# EAGLE design main-board (EAGLE 9.6.2)
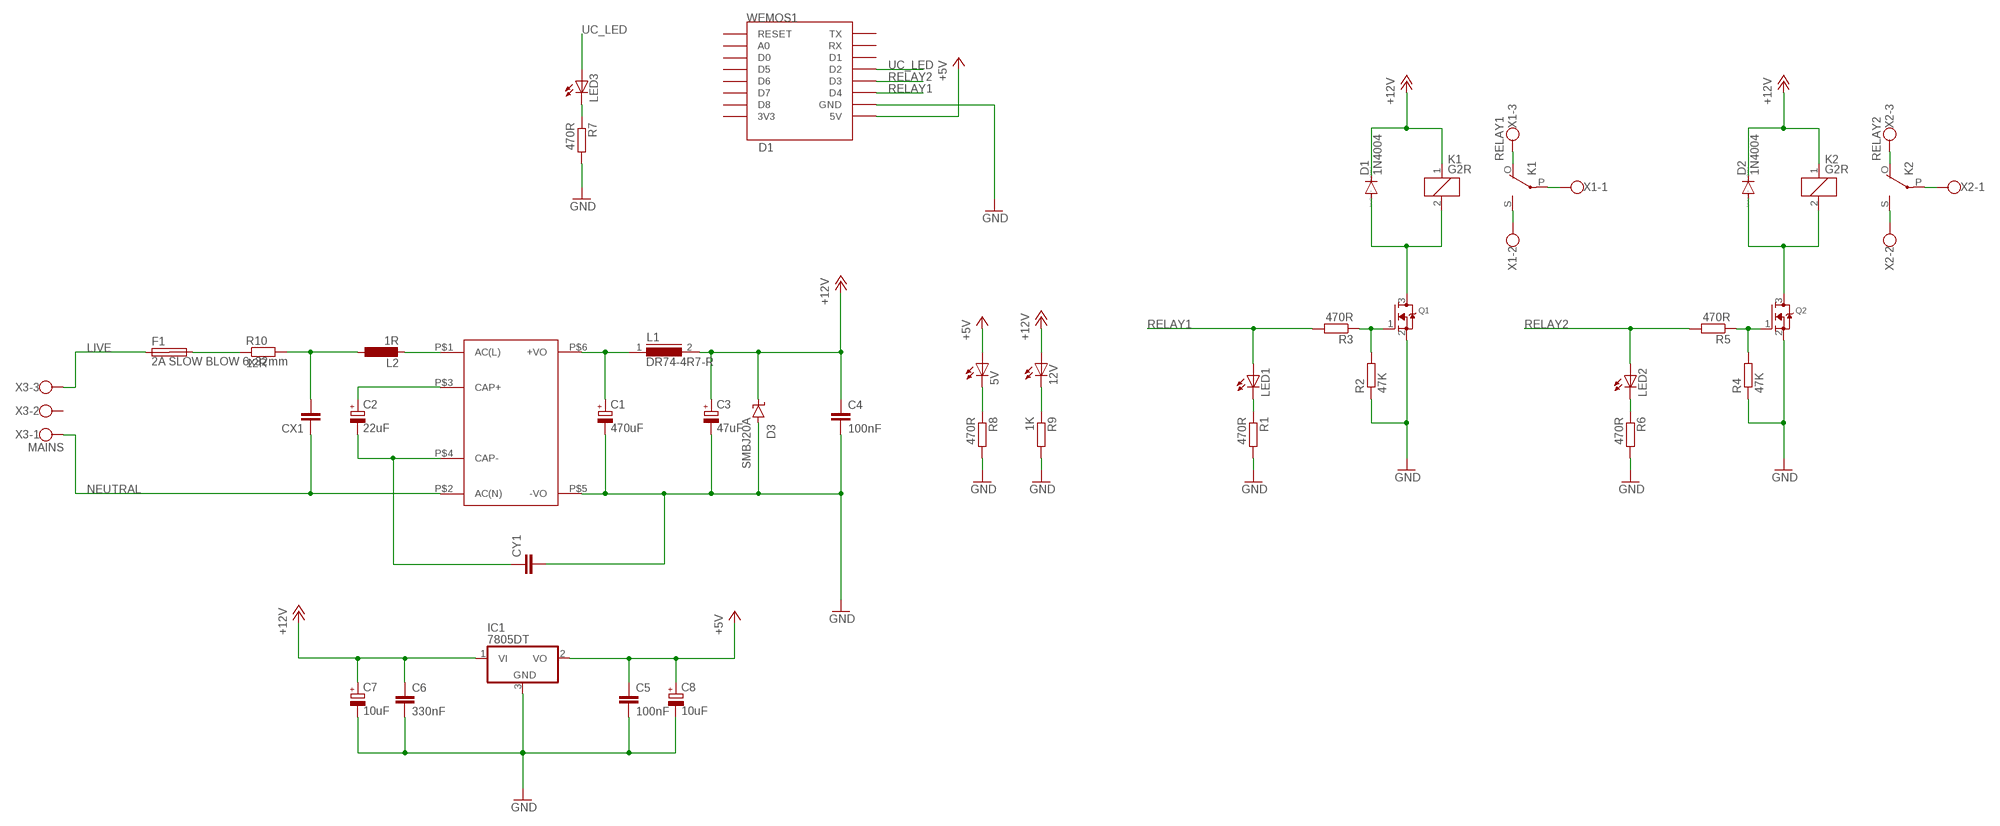
[diagram p0: schematic, sheet 1]

## Parts
5V  LEDSMT1206  [1206]
12V  LEDSMT1206  [1206]
C1  470uF  CPOL-EUE  [PANASONIC_E]
C2  22uF  CPOL-EUE7.5-16  [E7,5-16]
C3  47uF  CPOL-EUD  [PANASONIC_D]
C4  100nF  C-EUC0603  [C0603]
C5  100nF  C-EUC0603  [C0603]
C6  330nF  C-EUC0603  [C0603]
C7  10uF  CPOL-EUB  [PANASONIC_B]
C8  10uF  CPOL-EUB  [PANASONIC_B]
CX1  CXXC15B8  [XC15B8]
CY1  CYYC10B5  [YC10B5]
D1  1N4004  [DO41-10]
D2  1N4004  [DO41-10]
D3  SMBJ20A  SUPPRESSOR-SMBJ  [SMBJ]
F1  2A SLOW BLOW 6x32mm  SH32  [SH32]
IC1  7805DT  [TO252]
K1  G2R  [G2R]
K2  G2R  [G2R]
L1  DR74-4R7-R  DR74  [DR74]
L2  1R  L-EU6000-XXX-RC  [6000-XXXX-RC]
LED1  LEDSMT1206  [1206]
LED2  LEDSMT1206  [1206]
LED3  LEDSMT1206  [1206]
Q1  MOSFET-NREFLOW  [SOT23]
Q2  MOSFET-NREFLOW  [SOT23]
R1  470R  R-EU_R0603  [R0603]
R2  47K  R-EU_R0603  [R0603]
R3  470R  R-EU_R0603  [R0603]
R4  47K  R-EU_R0603  [R0603]
R5  470R  R-EU_R0603  [R0603]
R6  470R  R-EU_R0603  [R0603]
R7  470R  R-EU_R0603  [R0603]
R8  470R  R-EU_R0603  [R0603]
R9  1K  R-EU_R0603  [R0603]
R10  12R  R-EU_0922V  [0922V]
U$1  MP-LS05  [MP-LS05]
WEMOS1  D1  WEMOS-D1-MINI  [WEMOS-D1-MINI]
X1  RELAY1  W237-103  [W237-103]
X2  RELAY2  W237-103  [W237-103]
X3  MAINS  W237-103  [W237-103]

## Nets
+5V: 5V.A C5.1 C8.+ IC1.2(VO) WEMOS1.5V
+12V: 12V.A C3.+ C4.1 C6.1 C7.+ D1.C D2.C D3.C IC1.1(VI) K1.1 K2.1 L1.2
GND: C1.- C3.- C4.2 C5.2 C6.2 C7.- C8.- CY1.2 D3.A IC1.3(GND) Q1.2(S) Q2.2(S) R1.2 R2.1 R4.1 R6.2 R7.2 R8.2 R9.2 U$1.P$5(-VO) WEMOS1.GND
LIVE: F1.1A X3.3
N$1: D1.A K1.2 Q1.3(D)
N$2: Q1.1(G) R2.2 R3.1
N$3: LED1.C R1.1
N$4: K1.O(2:O) X1.3
N$5: K1.P(2:P) X1.1
N$6: K1.S(2:S) X1.2
N$7: D2.A K2.2 Q2.3(D)
N$8: LED2.C R6.1
N$9: K2.O(2:O) X2.3
N$10: K2.P(2:P) X2.1
N$11: K2.S(2:S) X2.2
N$12: Q2.1(G) R4.2 R5.1
N$14: LED3.C R7.1
N$15: 5V.C R8.1
N$16: 12V.C R9.1
N$17: C1.+ L1.1 U$1.P$6(+VO)
N$18: L2.2 U$1.P$1(AC(L))
N$19: F1.2A R10.1
N$20: C2.+ U$1.P$3(CAP+)
N$21: C2.- CY1.1 U$1.P$4(CAP-)
N$23: CX1.2 L2.1 R10.2
NEUTRAL: CX1.1 U$1.P$2(AC(N)) X3.1
RELAY1: LED1.A R3.2 WEMOS1.D4
RELAY2: LED2.A R5.2 WEMOS1.D3
UC_LED: LED3.A WEMOS1.D2
Unconnected: F1.1B F1.2B WEMOS1.3V3 WEMOS1.A0 WEMOS1.D0 WEMOS1.D1 WEMOS1.D5 WEMOS1.D6 WEMOS1.D7 WEMOS1.D8 WEMOS1.RESET WEMOS1.RX WEMOS1.TX X3.2

## Library data of the parts
5V 12V LED1-LED3 = adafruit:LED: LED OSRAM: - CHIPLED LG R971, LG N971, LY N971, LG Q971, LY Q971, LO R971, LY R971 LH N974, LH R974 LS Q976, LO Q976, LY Q976 LO Q996 - Hyper CHIPLED LW Q18S LB Q993, LB Q99A, LB R99A - SideLED LS A670, LO A670, LY A670, LG A670, LP A670 LB A673, LV A673, LT A673, LW A673 LH A674 LY A675 LS A676, LA A676, LO A676, LY A676, LW A676 LS A679, LY A679, LG A679 - Hyper Micro SIDELED® LS Y876, LA Y876, LO Y876, LY Y876 LT Y87S - SmartLED LW L88C, LW L88S LB L89C, LB L89S, LG L890 LS L89K, LO L89K, LY L89K LS L896, LA L896, LO L896, LY L896 - TOPLED LS T670, LO T670, LY T670, LG T670, LP T670 LSG T670, LSP T670, LSY T670, LOP T670, LYG T670 LG T671, LOG T671, LSG T671 LB T673, LV T673, LT T673, LW T673 LH T674 LS T676, LA T676, LO T676, LY T676, LB T676, LH T676, LSB T676, LW T676 LB T67C, LV T67C, LT T67C, LS T67K, LO T67K, LY T67K, LW E67C LS E67B, LA E67B, LO E67B, LY E67B, LB E67C, LV E67C, LT E67C LW T67C LS T679, LY T679, LG T679 LS T770, LO T770, LY T770, LG T770, LP T770 LB T773, LV T773, LT T773, LW T773 LH T774 LS E675, LA E675, LY E675, LS T675 LS T776, LA T776, LO T776, LY T776, LB T776 LHGB T686 LT T68C, LB T68C - Hyper Mini TOPLED® LB M676 - Mini TOPLED Santana® LG M470 LS M47K, LO M47K, LY M47K Source: http://www.osram.convergy.de/
C1-C3 C7 C8 = rcl:CPOL-EU: POLARIZED CAPACITOR, European symbol; SPICEPREFIX: C
C4-C6 = rcl:C-EU: CAPACITOR, European symbol; SPICEPREFIX: C
CX1 = rcl:CX: X CAPACITOR for power line; SPICEPREFIX: C
CY1 = rcl:CY: Y CAPACITOR for power line; SPICEPREFIX: C
D1 D2 = diode:1N4004: DIODE general purpose rectifier, 1 A
D3 = diode:SUPPRESSOR-: Suppressor diode
F1 = fuse:SH32: FUSE HOLDER 6 x 32 mm, SH contact, SHH3N Schukat, 102071 Wickmann (Buerklin); MPN: 10207101009; OC_FARNELL: 811786; OC_NEWARK: 76R6904
IC1 = linear:78*: Positive VOLTAGE REGULATOR Source: http://cache.national.com/ds/LM/LM78L05.pdf http://www.fairchildsemi.com/ds/LM/LM7805.pdf
K1 K2 = relay:G2R: RELAY 1 x switch, Omron; OC_FARNELL: 1569185; OC_NEWARK: unknown
L1 = inductors:DR74: High Power Density, High Efficiency, Shielded Inductors Source: coiltronics_dr_series.pdf; SPICEPREFIX: L
L2 = rcl:L-EU: INDUCTOR, European symbol; SPICEPREFIX: L
Q1 Q2 = adafruit:MOSFET-N: N-Channel Mosfet 2N7002E - 60V 260mA SOT23 [Digikey: 2N7002ET1GOSTR-ND] - REEL BSH103 - 30V 850mA SOT23 [Digikey: 568-5013-1-ND]
R1-R10 = rcl:R-EU_: RESISTOR, European symbol; SPICEPREFIX: R
U$1 = Simon's Libraries:MP-LS05: LS05-13BxxR3 AC/DC PCB Mount Power Supply (PSU), 70 to 430VDC, ITE, Household & Transformers, 1 Output, 5 W Farnell <https://uk.farnell.com/multicomp-pro/mp-ls05-13b12r3/power-supply-ac-dc-12v-0-42a/dp/3584011>
WEMOS1 = esp8266modules:WEMOS-D1-MINI: WeMos.cc D1 mini ESP8266 module
X1-X3 = con-wago-500:W237-103: WAGO SCREW CLAMP; MPN: 237-103; OC_FARNELL: unknown; OC_NEWARK: 18M7116

## Board
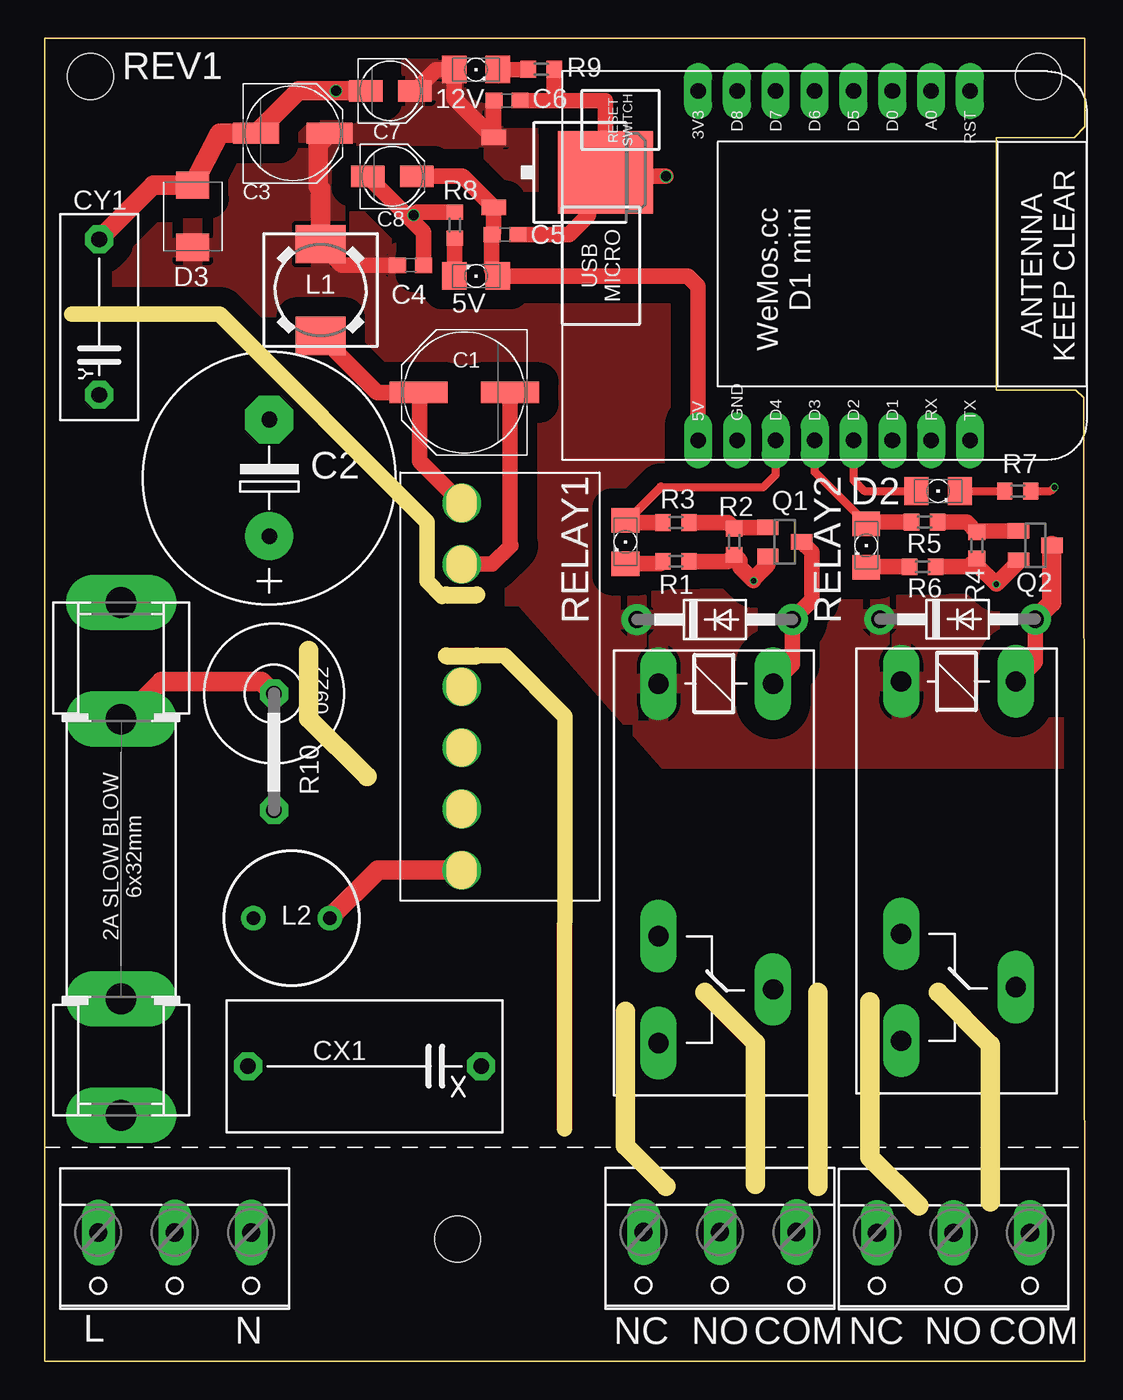
[diagram p1: board, top side]
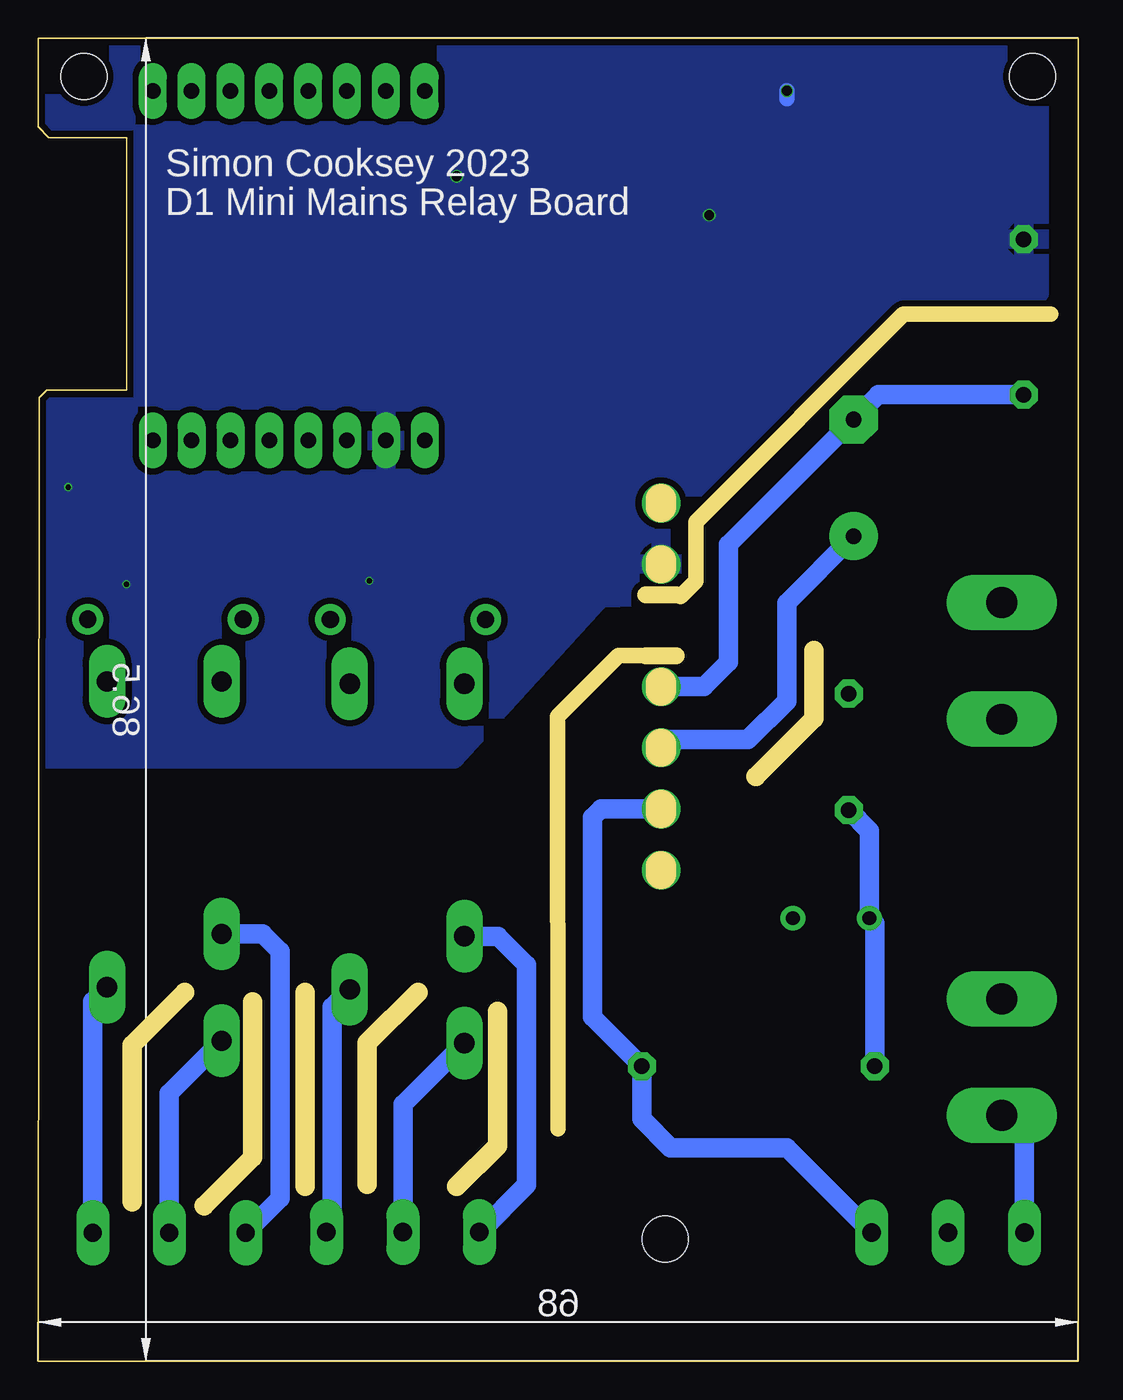
[diagram p2: board, bottom side, seen from below]

Size 68 x 86.5 mm. Coordinates in mm from the lower left corner, seen from the top.
Outline: 37.97,22.86 37.97,14.1 40.64,11.43
Outline: 43.18,24.13 46.48,20.83 46.48,11.56
Outline: 50.55,24.13 50.55,11.43
Outline: 53.98,23.5 53.98,13.34 57.15,10.16
Outline: 58.42,24.13 61.85,20.7 61.85,10.41
Outline: 26,50 25,51 25,54.88 11.43,68.45 1.78,68.45
Outline: 27.65,46.14 30.06,46.14 34.04,42.16 34,15.19
Outline: 17.27,46.48 17.27,42.04 21.08,38.23
Outline: 0,0 68,0 67.94,62.99 67.44,63.5 62.23,63.5 62.23,80.01 67.31,80.01 68,80.7 68,86.5 0,86.5 0,0
Copper layers (1*16): Top 0.035mm / dielectric 1.6mm / Bottom 0.035mm
Design rules "jlcpcb-2layers": minimum track width 5mil, minimum drill 0.3mm, track to track 5mil, track to pad 5mil, pad to pad 5mil, via to via 5mil, smd to smd 5mil, copper to edge 0.2mm, drill to drill 6mil, minimum pad ring 10mil, minimum via ring 3mil, stop-mask expansion 4mil, vias tented up to drill 0mil, thermal gap 10mil
Holes 3 mm at 3,84 65,84 27,8

### Footprints (pad centres in the part's own frame; a part is rotated, then mirrored left to right if it is on the bottom)
1206 = smd 1.6 x 1.803: A -1.422,0; C 1.422,0
PANASONIC_E = smd 3.8 x 1.4: + 3,0; - -3,0
E7,5-16 = drill 1.016 pad 3.15: + -3.81,0 | drill 1.016 pad 3.15 octagon: - 3.81,0
PANASONIC_D = smd 3 x 1.4: + 2.4,0; - -2.4,0
C0603 = smd 1.1 x 1: 1 -0.85,0; 2 0.85,0
PANASONIC_B = smd 2.2 x 1.4: + 1.6,0; - -1.6,0
XC15B8 = drill 1.016 octagon: 1 -7.62,0; 2 7.62,0
YC10B5 = drill 1.016 octagon: 1 -5.08,0; 2 5.08,0
DO41-10 = drill 1.118: A 5.08,0; C -5.08,0
SMBJ = smd 1.78 x 2.16: A 2.04,0; C -2.03,0
SH32 = drill 2.007 long: 1A -16.764,0; 1B -9.144,0; 2A 9.144,0; 2B 16.764,0
TO252 = smd 1 x 1.6: 1 -2.28,-4.8; 2 2.28,-4.8 | smd 5.4 x 6.2: 3 0,2.5
G2R = drill 1.321 long: 1 -2.54,-3.683; 2 -2.54,3.81; O 13.97,-3.683; P 17.45,3.81; S 20.955,-3.683
DR74 = smd 2.5 x 3.25: 1 -3,0; 2 3,0
6000-XXXX-RC = drill 0.9 pad 1.422: 1 -2.5,0; 2 2.5,0
SOT23 = smd 1 x 1.4: 1 -0.95,-1.1; 2 0.95,-1.1; 3 0,1.1
R0603 = smd 1 x 1.1: 1 -0.85,0; 2 0.85,0
0922V = drill 1.016 octagon: 1 -5.08,0; 2 2.54,0
MP-LS05 = drill 1.4: P$1 0,0; P$2 4,0; P$3 8,0; P$4 12,0; P$5 20,0; P$6 24,0
WEMOS-D1-MINI = drill 1.016 pad 1.829 long: 3V3 -10.16,-10.16; 5V 12.7,-10.16; A0 -10.16,5.08; D0 -10.16,2.54; D1 12.7,2.54; D2 12.7,0; D3 12.7,-2.54; D4 12.7,-5.08; D5 -10.16,0; D6 -10.16,-2.54; D7 -10.16,-5.08; D8 -10.16,-7.62; GND 12.7,-7.62; RESET -10.16,7.62; RX 12.7,5.08; TX 12.7,7.62
W237-103 = drill 1.194 long: 1 -5,-1.29; 2 0,-1.29; 3 5,-1.29

### Placement (x,y rotation side)
5V  28.21,70.95 180 top
12V  28.21,84.44 0 top
C1  27.44,63.34 180 top
C2  14.69,57.76 90 top
C3  16.23,80.29 0 top
C4  23.92,71.65 0 top
C5  30.1,73.66 0 top
C6  30.23,82.42 0 top
C7  22.61,83.06 0 top
C8  22.73,77.47 0 top
CX1  20.92,19.29 180 top
CY1  3.57,68.27 90 top
D1  43.82,48.49 0 top
D2  59.69,48.51 0 top
D3  9.69,74.85 90 top
F1  5,32.84 90 top
IC1  34.16,77.72 270 top
K1  43.82,41.76 270 top
K2  59.69,41.91 270 top
L1  18.04,70.04 90 top
L2  16.15,28.97 0 top
LED1  37.98,53.57 270 top
LED2  53.72,53.34 270 top
LED3  58.42,56.9 0 top
Q1  48.39,53.57 270 top
Q2  64.77,53.34 270 top
R1  41.28,52.3 0 top
R2  45.09,53.57 90 top
R3  41.28,54.84 180 top
R4  60.96,53.34 90 top
R5  57.53,54.86 180 top
R6  57.4,51.94 0 top
R7  63.63,56.9 0 top
R8  26.82,74.28 90 top
R9  32.47,84.47 0 top
R10  15,38.57 270 top
U$1  27.27,32.11 90 top
WEMOS1  52.89,72.9 270 top
X1  44.16,7.15 180 top
X2  59.44,7.11 180 top
X3  8.51,7.13 180 top

### Tracks (layer width: path | path; a pad name or v marks a point on that pad's centre or on a via)
+5V
  Top 1.016: C8.+ 27.34,77.47 IC1.2 29.36,73.77 C5.1 29.21,73.62 29.21,71.38 5V.A 42.08,70.95 42.73,70.3 WEMOS1.5V
+12V
  Top 1.016: C6.1 29.36,82.41 IC1.1 26.79,82.58 12V.A 25.59,84.44 C7.+ | L1.2 19.43,71.65 C4.1
  Top 1.27: L1.2 18.04,76.68 17.89,76.84 17.89,79.55 C3.+
  pour Top (isolate 1.27): 1.27,86.36 68.58,86.36 68.58,39.37 40.76,39.37 40.76,39.25 31.28,50 24.73,50 24.73,56.55 11.43,69.85 1.27,69.85
GND  (via drill 0.35, 0.65)
  Top 0.508: R7.2 65.79,56.9 v66.04,57.15
  Top 1.016: Q1.2 47.29,52.09 46.36,51.16 v46.36,51.03 45.47,51.92 45.47,52.34 R2.1 44.67,52.3 R1.2 | R6.2 60.41,51.94 R4.1 60.96,52.07 v62.23,50.8 63.67,52.24 Q2.2 | IC1.3 36.66,82.42 33.02,82.42 | 33.02,82.42 C6.2 | IC1.3 35.01,77.72 35.56,74.93 34.29,73.66 C5.2 | IC1.3 36.92,77.47 v40.64,77.47 | C8.- 23.9,74.7 | 23.9,74.7 v24.13,74.93 24.33,75.13 R8.2 | C7.- v19.05,83.06 | C4.2 24.77,73.83 23.9,74.7 | 30.44,63.54 C1.- 30.44,53.38 30.48,53.34 29.25,52.11 U$1.P$5 | R9.2 33.32,82.72 33.02,82.42
  Top 1.27: CY1.2 7.11,76.89 D3.A 11.44,80.29 C3.- 16.6,83.06 C7.-
  Bottom 1.016: v19.05,83.06 19.05,82.55
  pour Bottom (isolate 0.406): 2.54,86.36 68.58,86.36 68.58,39.37 40.8,39.37 31.24,49.91 26.29,50.04 24.46,51.87 24.46,56.82 11.43,69.85 2.54,69.85
LIVE
  Bottom 1.27: F1.1A 3.51,14.59 X3.3
N$1
  Top 1.016: Q1.3 50.17,52.89 50.17,49.76 D1.A 48.9,45.57 K1.2
N$2
  Top 1.016: Q1.1 45.19,54.52 R2.2 44.67,54.84 R3.1
N$3
  Top 1.016: R1.1 40.28,52.15 LED1.C
N$4
  Bottom 1.27: K1.O 37.95,27.79 36.07,25.91 36.07,11.53 X1.3
N$5
  Bottom 1.27: K1.P 48.78,23.16 48.78,8.82 X1.1
N$6
  Bottom 1.27: K1.S 44.16,16.78 X1.2
N$7
  Top 1.016: K2.2 64.77,45.72 D2.A
  Top 1.27: Q2.3 65.87,49.61 D2.A
N$8
  Top 1.016: R6.1 53.75,51.94 LED2.C
N$9
  Bottom 1.27: X2.3 52.2,10.64 52.2,26.8 53.34,27.94 K2.O
N$10
  Bottom 1.27: K2.P 64.44,23.52 X2.1
N$11
  Bottom 1.27: K2.S 59.44,17.53 X2.2
N$12
  Top 1.016: R5.1 60.29,54.86 R4.2 61.06,54.29 Q2.1
N$14
  Top 0.508: LED3.C R7.1
N$15
  Top 1.016: R8.1 26.82,70.98 5V.C
N$16
  Top 1.016: 12V.C 31.6,84.44 R9.1
N$17
  Top 1.016: L1.1 21.74,63.34 C1.+ 24.51,63.27 24.51,58.87 U$1.P$6
N$18
  Top 1.27: L2.2 21.79,32.11 U$1.P$1
N$19
  Top 1.27: F1.2A 5.15,41.98 7.62,44.45 14.2,44.45 R10.1
N$20
  Bottom 1.27: U$1.P$3 26.74,40.64 21.59,40.64 19.05,43.18 19.05,49.59 C2.+
N$21
  Bottom 1.27: U$1.P$4 24.47,44.11 22.86,45.72 22.86,53.4 C2.- 13.06,63.19 CY1.1
N$23
  Bottom 1.27: R10.2 13.65,34.68 L2.1 13.3,28.62 CX1.2
NEUTRAL
  Bottom 1.27: U$1.P$2 31.2,36.11 31.75,35.56 31.75,22.5 CX1.1 28.54,15.84 26.67,13.97 19.06,13.97 X3.1
RELAY1
  Top 0.508: 40.29,57.15 46.99,57.15 47.81,57.97 WEMOS1.D4
  Top 0.61: 37.98,54.84 40.29,57.15
  Top 1.016: R3.2 37.98,54.84 LED1.A
RELAY2
  Top 0.508: LED2.A 50.35,58.13 WEMOS1.D3
  Top 1.016: R5.2 53.82,54.86 LED2.A
UC_LED
  Top 0.508: WEMOS1.D2 52.89,57.6 53.59,56.9 LED3.A

### Text on the board
tNames: REV1 | D2 | RELAY1 | RELAY2 | 2A SLOW BLOW / 6x32mm | L | N | NC | NO | COM | NC | NO | COM
bNames: Simon Cooksey 2023 | D1 Mini Mains Relay Board